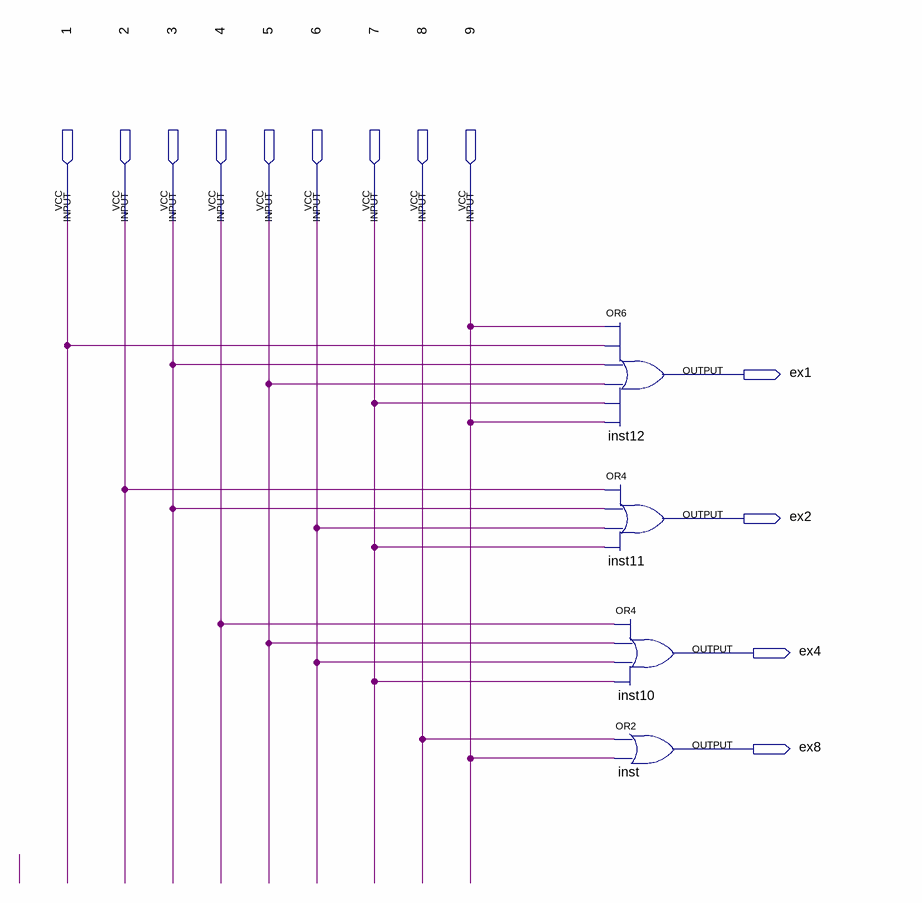
[diagram p0: schematic sheet]
// Quartus schematic Coder.bdf as structural Verilog: 4 symbols, 13 pins
module Coder (
  input  \1 ,
  input  \2 ,
  input  \3 ,
  input  \4 ,
  input  \5 ,
  input  \6 ,
  input  \7 ,
  input  \8 ,
  input  \9 ,
  output ex1,
  output ex2,
  output ex4,
  output ex8
);

  or inst12 (ex1, \9 , \1 , \3 , \5 , \7 , \9 );
  or inst11 (ex2, \2 , \3 , \6 , \7 );
  or inst10 (ex4, \4 , \5 , \6 , \7 );
  or inst (ex8, \8 , \9 );
endmodule
